# Altium project Keyboard_100.PrjPcb
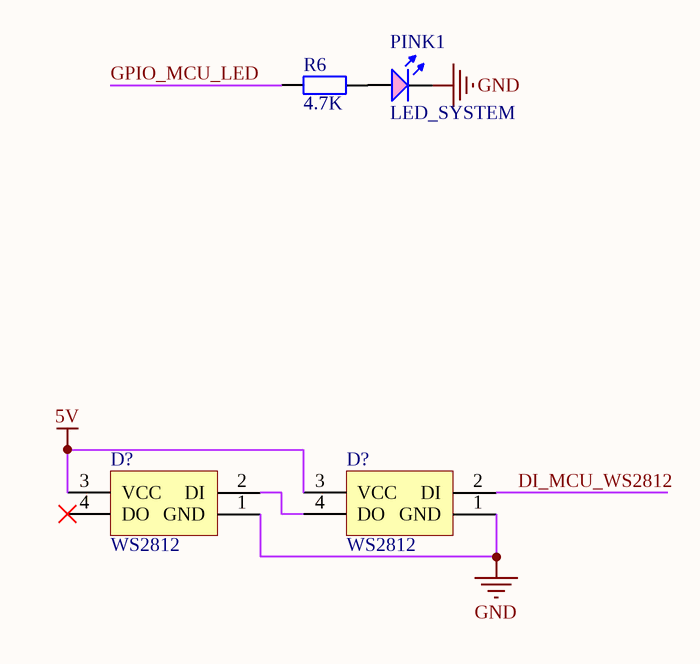
[diagram p0: LED.SchDoc]
4 sheets, 226 parts. Net scope: global (net labels, ports and power ports of the same name join across sheets).
Board file: Keyboard_100.PcbDoc
Sheets:
  LED.SchDoc
  KEY_Pad.SchDoc
  MCU.SchDoc
  NRF24L01.SchDoc

## Sheet LED.SchDoc
size A4

### Parts
(Parts that share a designator on the sheet are numbered #1, #2 ... from top to bottom, then left to right.)
D?#1  WS2812  [RGB_LED_1206]
D?#2  WS2812  [RGB_LED_1206]
PINK1  LED_SYSTEM  [LED_0603_R]
R6  4.7K  [Res-0603]

### Nets
5V: D?#1.3(VCC) D?#2.3(VCC)
GND: D?#1.1(GND) D?#2.1(GND) PINK1.2(K)
DI_MCU_WS2812: D?#2.2(DI)
GPIO_MCU_LED: R6.2
NetD?#1_2: D?#1.2(DI) D?#2.4(DO)
NetPINK1_1: PINK1.1(A) R6.1

Not connected (* = marked no-connect by the designer): D?#1 4(DO)*

### Notes on the sheet
- Title
- Size:
- Date:
- A4
- Number:
- Time:
- Revision:
- Sheet
- of
- File:

### Library data of the parts
PINK1 = LED_SMD_PINK: 发光二极管; ComponentLink1Description: 供应商链接; ComponentLink1URL: http://www.szlcsc.com/product/details_2659.html; Package: 0603; Supplier: LC; SuppliersPartNumber: C2286
R6 = RES: 贴片电阻
D?#1 D?#2 = WS2812: Publisher: mazhongwei; Published: 8-August-2017; PackageReference: RGB_LED_5050

## Sheet KEY_Pad.SchDoc
size A2
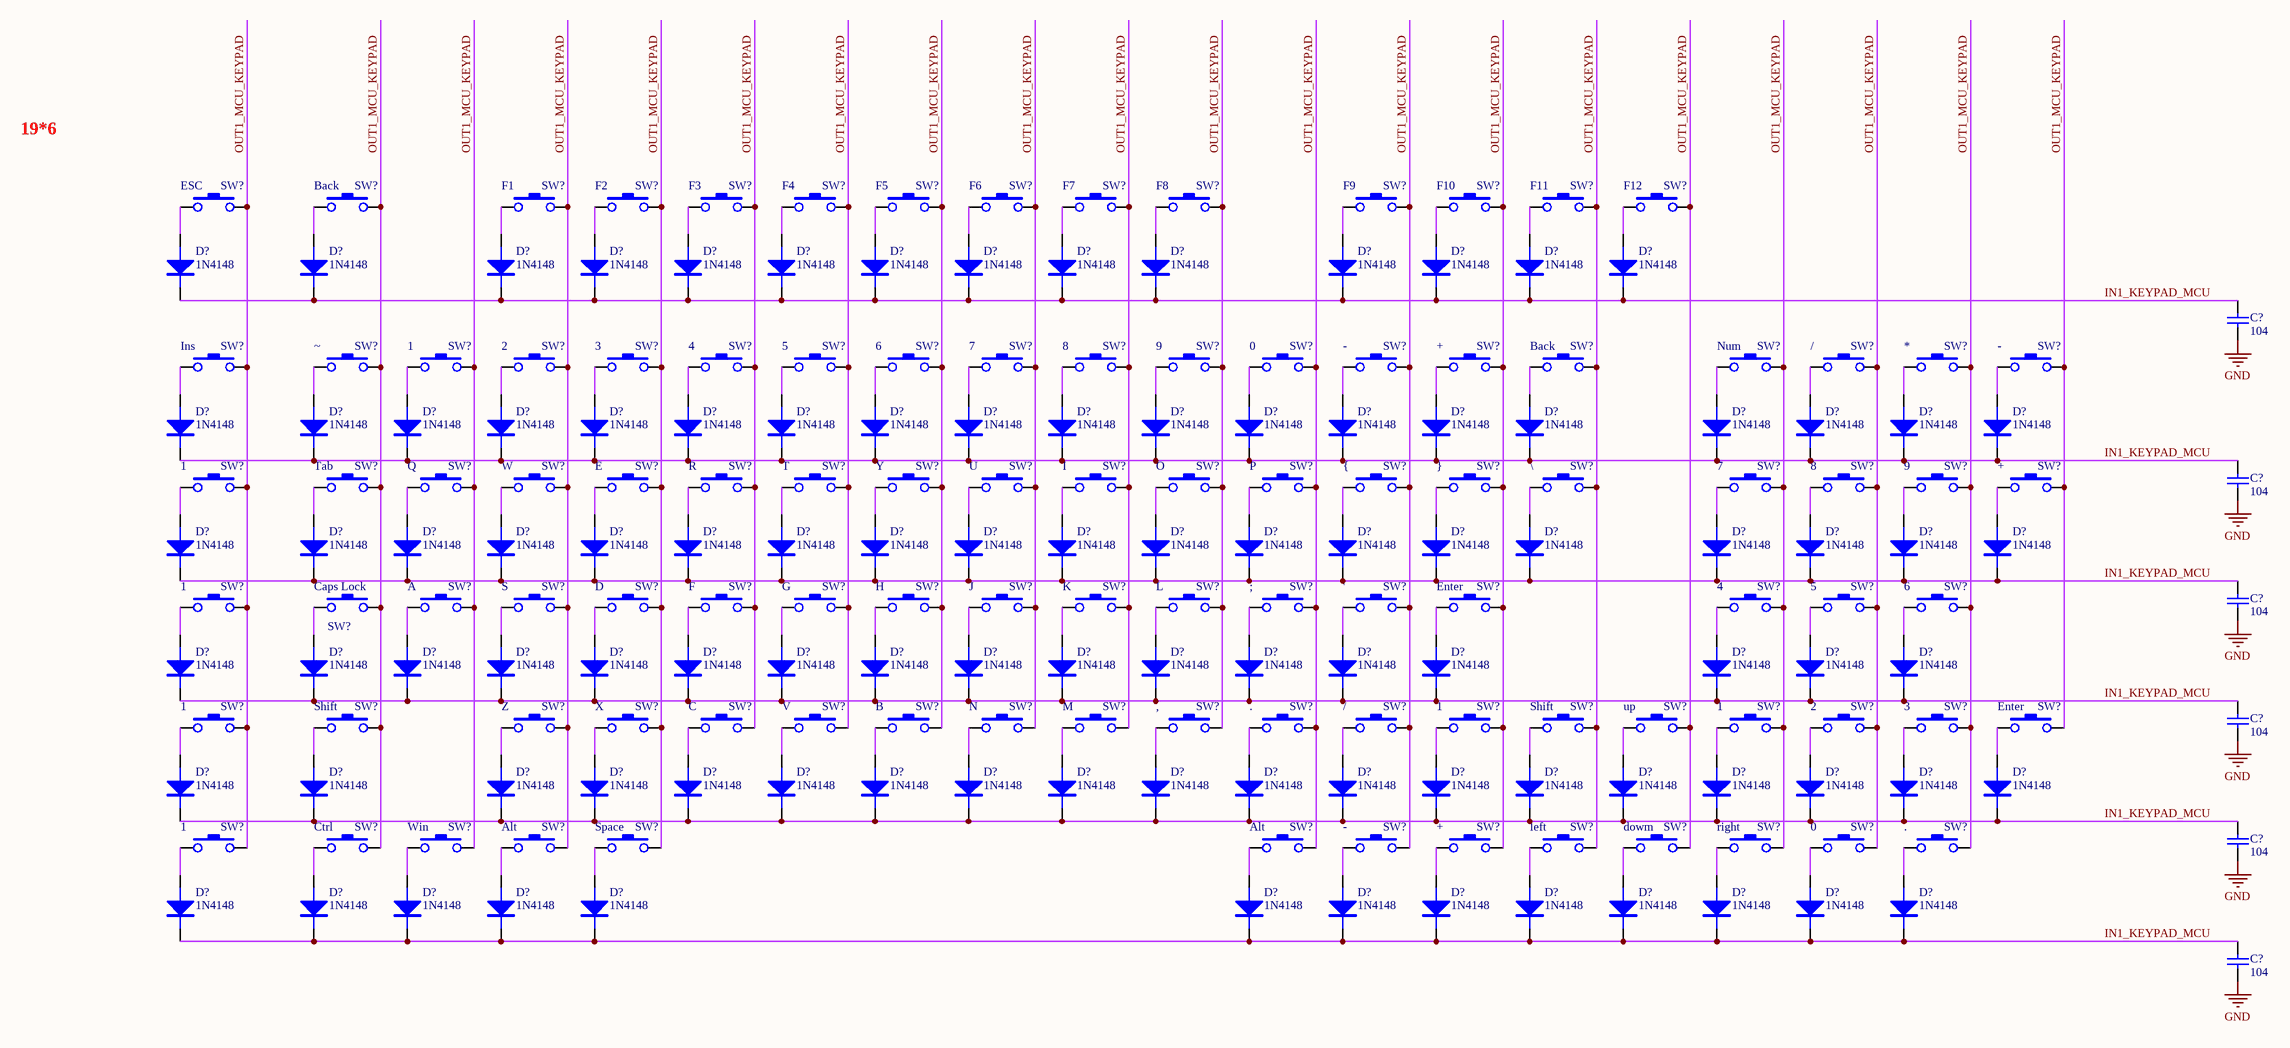
[diagram p1: KEY_Pad.SchDoc]

### Parts
(Parts that share a designator on the sheet are numbered #1, #2 ... from top to bottom, then left to right.)
C?#1  104  [Cap-0603]
C?#2  104  [Cap-0603]
C?#3  104  [Cap-0603]
C?#4  104  [Cap-0603]
C?#5  104  [Cap-0603]
C?#6  104  [Cap-0603]
D?#3  1N4148  [SOD-523]
D?#4  1N4148  [SOD-523]
D?#5  1N4148  [SOD-523]
D?#6  1N4148  [SOD-523]
D?#7  1N4148  [SOD-523]
D?#8  1N4148  [SOD-523]
D?#9  1N4148  [SOD-523]
D?#10  1N4148  [SOD-523]
D?#11  1N4148  [SOD-523]
D?#12  1N4148  [SOD-523]
D?#13  1N4148  [SOD-523]
D?#14  1N4148  [SOD-523]
D?#15  1N4148  [SOD-523]
D?#16  1N4148  [SOD-523]
D?#17  1N4148  [SOD-523]
D?#18  1N4148  [SOD-523]
D?#19  1N4148  [SOD-523]
D?#20  1N4148  [SOD-523]
D?#21  1N4148  [SOD-523]
D?#22  1N4148  [SOD-523]
D?#23  1N4148  [SOD-523]
D?#24  1N4148  [SOD-523]
D?#25  1N4148  [SOD-523]
D?#26  1N4148  [SOD-523]
D?#27  1N4148  [SOD-523]
D?#28  1N4148  [SOD-523]
D?#29  1N4148  [SOD-523]
D?#30  1N4148  [SOD-523]
D?#31  1N4148  [SOD-523]
D?#32  1N4148  [SOD-523]
D?#33  1N4148  [SOD-523]
D?#34  1N4148  [SOD-523]
D?#35  1N4148  [SOD-523]
D?#36  1N4148  [SOD-523]
D?#37  1N4148  [SOD-523]
D?#38  1N4148  [SOD-523]
D?#39  1N4148  [SOD-523]
D?#40  1N4148  [SOD-523]
D?#41  1N4148  [SOD-523]
D?#42  1N4148  [SOD-523]
D?#43  1N4148  [SOD-523]
D?#44  1N4148  [SOD-523]
D?#45  1N4148  [SOD-523]
D?#46  1N4148  [SOD-523]
D?#47  1N4148  [SOD-523]
D?#48  1N4148  [SOD-523]
D?#49  1N4148  [SOD-523]
D?#50  1N4148  [SOD-523]
D?#51  1N4148  [SOD-523]
D?#52  1N4148  [SOD-523]
D?#53  1N4148  [SOD-523]
D?#54  1N4148  [SOD-523]
D?#55  1N4148  [SOD-523]
D?#56  1N4148  [SOD-523]
D?#57  1N4148  [SOD-523]
D?#58  1N4148  [SOD-523]
D?#59  1N4148  [SOD-523]
D?#60  1N4148  [SOD-523]
D?#61  1N4148  [SOD-523]
D?#62  1N4148  [SOD-523]
D?#63  1N4148  [SOD-523]
D?#64  1N4148  [SOD-523]
D?#65  1N4148  [SOD-523]
D?#66  1N4148  [SOD-523]
D?#67  1N4148  [SOD-523]
D?#68  1N4148  [SOD-523]
D?#69  1N4148  [SOD-523]
D?#70  1N4148  [SOD-523]
D?#71  1N4148  [SOD-523]
D?#72  1N4148  [SOD-523]
D?#73  1N4148  [SOD-523]
D?#74  1N4148  [SOD-523]
D?#75  1N4148  [SOD-523]
D?#76  1N4148  [SOD-523]
D?#77  1N4148  [SOD-523]
D?#78  1N4148  [SOD-523]
D?#79  1N4148  [SOD-523]
D?#80  1N4148  [SOD-523]
D?#81  1N4148  [SOD-523]
D?#82  1N4148  [SOD-523]
D?#83  1N4148  [SOD-523]
D?#84  1N4148  [SOD-523]
D?#85  1N4148  [SOD-523]
D?#86  1N4148  [SOD-523]
D?#87  1N4148  [SOD-523]
D?#88  1N4148  [SOD-523]
D?#89  1N4148  [SOD-523]
D?#90  1N4148  [SOD-523]
D?#91  1N4148  [SOD-523]
D?#92  1N4148  [SOD-523]
D?#93  1N4148  [SOD-523]
D?#94  1N4148  [SOD-523]
D?#95  1N4148  [SOD-523]
D?#96  1N4148  [SOD-523]
D?#97  1N4148  [SOD-523]
D?#98  1N4148  [SOD-523]
D?#99  1N4148  [SOD-523]
D?#100  1N4148  [SOD-523]
D?#101  1N4148  [SOD-523]
D?#102  1N4148  [SOD-523]
D?#103  1N4148  [SOD-523]
SW?#1  ESC  [MX_SW-4]
SW?#2  Back  [MX_SW-4]
SW?#3  F1  [MX_SW-4]
SW?#4  F2  [MX_SW-4]
SW?#5  F3  [MX_SW-4]
SW?#6  F4  [MX_SW-4]
SW?#7  F5  [MX_SW-4]
SW?#8  F6  [MX_SW-4]
SW?#9  F7  [MX_SW-4]
SW?#10  F8  [MX_SW-4]
SW?#11  F9  [MX_SW-4]
SW?#12  F10  [MX_SW-4]
SW?#13  F11  [MX_SW-4]
SW?#14  F12  [MX_SW-4]
SW?#15  Ins  [MX_SW-4]
SW?#16  ~  [MX_SW-4]
SW?#17  1  [MX_SW-4]
SW?#18  2  [MX_SW-4]
SW?#19  3  [MX_SW-4]
SW?#20  4  [MX_SW-4]
SW?#21  5  [MX_SW-4]
SW?#22  6  [MX_SW-4]
SW?#23  7  [MX_SW-4]
SW?#24  8  [MX_SW-4]
SW?#25  9  [MX_SW-4]
SW?#26  0  [MX_SW-4]
SW?#27  -  [MX_SW-4]
SW?#28  +  [MX_SW-4]
SW?#29  Back  [MX_SW-4]
SW?#30  Num  [MX_SW-4]
SW?#31  /  [MX_SW-4]
SW?#32  *  [MX_SW-4]
SW?#33  -  [MX_SW-4]
SW?#34  1  [MX_SW-4]
SW?#35  Tab  [MX_SW-4]
SW?#36  Q  [MX_SW-4]
SW?#37  W  [MX_SW-4]
SW?#38  E  [MX_SW-4]
SW?#39  R  [MX_SW-4]
SW?#40  T  [MX_SW-4]
SW?#41  Y  [MX_SW-4]
SW?#42  U  [MX_SW-4]
SW?#43  I  [MX_SW-4]
SW?#44  O  [MX_SW-4]
SW?#45  P  [MX_SW-4]
SW?#46  {  [MX_SW-4]
SW?#47  }  [MX_SW-4]
SW?#48  \  [MX_SW-4]
SW?#49  7  [MX_SW-4]
SW?#50  8  [MX_SW-4]
SW?#51  9  [MX_SW-4]
SW?#52  +  [MX_SW-4]
SW?#53  1  [MX_SW-4]
SW?#54  Caps Lock  [MX_SW-4]
SW?#55  A  [MX_SW-4]
SW?#56  S  [MX_SW-4]
SW?#57  D  [MX_SW-4]
SW?#58  F  [MX_SW-4]
SW?#59  G  [MX_SW-4]
SW?#60  H  [MX_SW-4]
SW?#61  J  [MX_SW-4]
SW?#62  K  [MX_SW-4]
SW?#63  L  [MX_SW-4]
SW?#64  ;  [MX_SW-4]
SW?#65  '  [MX_SW-4]
SW?#66  Enter  [MX_SW-4]
SW?#67  4  [MX_SW-4]
SW?#68  5  [MX_SW-4]
SW?#69  6  [MX_SW-4]
SW?#70  1  [MX_SW-4]
SW?#71  Shift  [MX_SW-4]
SW?#72  Z  [MX_SW-4]
SW?#73  X  [MX_SW-4]
SW?#74  C  [MX_SW-4]
SW?#75  V  [MX_SW-4]
SW?#76  B  [MX_SW-4]
SW?#77  N  [MX_SW-4]
SW?#78  M  [MX_SW-4]
SW?#79  ,  [MX_SW-4]
SW?#80  .  [MX_SW-4]
SW?#81  /  [MX_SW-4]
SW?#82  1  [MX_SW-4]
SW?#83  Shift  [MX_SW-4]
SW?#84  up  [MX_SW-4]
SW?#85  1  [MX_SW-4]
SW?#86  2  [MX_SW-4]
SW?#87  3  [MX_SW-4]
SW?#88  Enter  [MX_SW-4]
SW?#89  1  [MX_SW-4]
SW?#90  Ctrl  [MX_SW-4]
SW?#91  Win  [MX_SW-4]
SW?#92  Alt  [MX_SW-4]
SW?#93  Space  [MX_SW-4]
SW?#94  Alt  [MX_SW-4]
SW?#95  -  [MX_SW-4]
SW?#96  +  [MX_SW-4]
SW?#97  left  [MX_SW-4]
SW?#98  dowm  [MX_SW-4]
SW?#99  right  [MX_SW-4]
SW?#100  0  [MX_SW-4]
SW?#101  .  [MX_SW-4]

### Nets
GND: C?#1.2 C?#2.2 C?#3.2 C?#4.2 C?#5.2 C?#6.2
IN1_KEYPAD_MCU: C?#1.1 C?#2.1 C?#3.1 C?#4.1 C?#5.1 C?#6.1 D?#3.K D?#4.K D?#5.K D?#6.K D?#7.K D?#8.K D?#9.K D?#10.K D?#11.K D?#12.K D?#13.K D?#14.K D?#15.K D?#16.K D?#17.K D?#18.K D?#19.K D?#20.K D?#21.K D?#22.K D?#23.K D?#24.K D?#25.K D?#26.K D?#27.K D?#28.K D?#29.K D?#30.K D?#31.K D?#32.K D?#33.K D?#34.K D?#35.K D?#36.K D?#37.K D?#38.K D?#39.K D?#40.K D?#41.K D?#42.K D?#43.K D?#44.K D?#45.K D?#46.K D?#47.K D?#48.K D?#49.K D?#50.K D?#51.K D?#52.K D?#53.K D?#54.K D?#55.K D?#56.K D?#57.K D?#58.K D?#59.K D?#60.K D?#61.K D?#62.K D?#63.K D?#64.K D?#65.K D?#66.K D?#67.K D?#68.K D?#69.K D?#70.K D?#71.K D?#72.K D?#73.K D?#74.K D?#75.K D?#76.K D?#77.K D?#78.K D?#79.K D?#80.K D?#81.K D?#82.K D?#83.K D?#84.K D?#85.K D?#86.K D?#87.K D?#88.K D?#89.K D?#90.K D?#91.K D?#92.K D?#93.K D?#94.K D?#95.K D?#96.K D?#97.K D?#98.K D?#99.K D?#100.K D?#101.K D?#102.K D?#103.K
OUT1_MCU_KEYPAD: SW?#1.2 SW?#2.2 SW?#3.2 SW?#4.2 SW?#5.2 SW?#6.2 SW?#7.2 SW?#8.2 SW?#9.2 SW?#10.2 SW?#11.2 SW?#12.2 SW?#13.2 SW?#14.2 SW?#15.2 SW?#16.2 SW?#17.2 SW?#18.2 SW?#19.2 SW?#20.2 SW?#21.2 SW?#22.2 SW?#23.2 SW?#24.2 SW?#25.2 SW?#26.2 SW?#27.2 SW?#28.2 SW?#29.2 SW?#30.2 SW?#31.2 SW?#32.2 SW?#33.2 SW?#34.2 SW?#35.2 SW?#36.2 SW?#37.2 SW?#38.2 SW?#39.2 SW?#40.2 SW?#41.2 SW?#42.2 SW?#43.2 SW?#44.2 SW?#45.2 SW?#46.2 SW?#47.2 SW?#48.2 SW?#49.2 SW?#50.2 SW?#51.2 SW?#52.2 SW?#53.2 SW?#54.2 SW?#55.2 SW?#56.2 SW?#57.2 SW?#58.2 SW?#59.2 SW?#60.2 SW?#61.2 SW?#62.2 SW?#63.2 SW?#64.2 SW?#65.2 SW?#66.2 SW?#67.2 SW?#68.2 SW?#69.2 SW?#70.2 SW?#71.2 SW?#72.2 SW?#73.2 SW?#74.2 SW?#75.2 SW?#76.2 SW?#77.2 SW?#78.2 SW?#79.2 SW?#80.2 SW?#81.2 SW?#82.2 SW?#83.2 SW?#84.2 SW?#85.2 SW?#86.2 SW?#87.2 SW?#88.2 SW?#89.2 SW?#90.2 SW?#91.2 SW?#92.2 SW?#93.2 SW?#94.2 SW?#95.2 SW?#96.2 SW?#97.2 SW?#98.2 SW?#99.2 SW?#100.2 SW?#101.2
NetD?#3_A: D?#3.A SW?#1.1
NetD?#4_A: D?#4.A SW?#2.1
NetD?#5_A: D?#5.A SW?#3.1
NetD?#6_A: D?#6.A SW?#4.1
NetD?#7_A: D?#7.A SW?#5.1
NetD?#8_A: D?#8.A SW?#6.1
NetD?#9_A: D?#9.A SW?#7.1
NetD?#10_A: D?#10.A SW?#8.1
NetD?#11_A: D?#11.A SW?#9.1
NetD?#12_A: D?#12.A SW?#10.1
NetD?#13_A: D?#13.A SW?#11.1
NetD?#14_A: D?#14.A SW?#12.1
NetD?#15_A: D?#15.A SW?#13.1
NetD?#16_A: D?#16.A SW?#14.1
NetD?#17_A: D?#17.A SW?#15.1
NetD?#18_A: D?#18.A SW?#16.1
NetD?#19_A: D?#19.A SW?#17.1
NetD?#20_A: D?#20.A SW?#18.1
NetD?#21_A: D?#21.A SW?#19.1
NetD?#22_A: D?#22.A SW?#20.1
NetD?#23_A: D?#23.A SW?#21.1
NetD?#24_A: D?#24.A SW?#22.1
NetD?#25_A: D?#25.A SW?#23.1
NetD?#26_A: D?#26.A SW?#24.1
NetD?#27_A: D?#27.A SW?#25.1
NetD?#28_A: D?#28.A SW?#26.1
NetD?#29_A: D?#29.A SW?#27.1
NetD?#30_A: D?#30.A SW?#28.1
NetD?#31_A: D?#31.A SW?#29.1
NetD?#32_A: D?#32.A SW?#30.1
NetD?#33_A: D?#33.A SW?#31.1
NetD?#34_A: D?#34.A SW?#32.1
NetD?#35_A: D?#35.A SW?#33.1
NetD?#36_A: D?#36.A SW?#34.1
NetD?#37_A: D?#37.A SW?#35.1
NetD?#38_A: D?#38.A SW?#36.1
NetD?#39_A: D?#39.A SW?#37.1
NetD?#40_A: D?#40.A SW?#38.1
NetD?#41_A: D?#41.A SW?#39.1
NetD?#42_A: D?#42.A SW?#40.1
NetD?#43_A: D?#43.A SW?#41.1
NetD?#44_A: D?#44.A SW?#42.1
NetD?#45_A: D?#45.A SW?#43.1
NetD?#46_A: D?#46.A SW?#44.1
NetD?#47_A: D?#47.A SW?#45.1
NetD?#48_A: D?#48.A SW?#46.1
NetD?#49_A: D?#49.A SW?#47.1
NetD?#50_A: D?#50.A SW?#48.1
NetD?#51_A: D?#51.A SW?#49.1
NetD?#52_A: D?#52.A SW?#50.1
NetD?#53_A: D?#53.A SW?#51.1
NetD?#54_A: D?#54.A SW?#52.1
NetD?#55_A: D?#55.A SW?#53.1
NetD?#56_A: D?#56.A SW?#54.1
NetD?#57_A: D?#57.A SW?#55.1
NetD?#58_A: D?#58.A SW?#56.1
NetD?#59_A: D?#59.A SW?#57.1
NetD?#60_A: D?#60.A SW?#58.1
NetD?#61_A: D?#61.A SW?#59.1
NetD?#62_A: D?#62.A SW?#60.1
NetD?#63_A: D?#63.A SW?#61.1
NetD?#64_A: D?#64.A SW?#62.1
NetD?#65_A: D?#65.A SW?#63.1
NetD?#66_A: D?#66.A SW?#64.1
NetD?#67_A: D?#67.A SW?#65.1
NetD?#68_A: D?#68.A SW?#66.1
NetD?#69_A: D?#69.A SW?#67.1
NetD?#70_A: D?#70.A SW?#68.1
NetD?#71_A: D?#71.A SW?#69.1
NetD?#72_A: D?#72.A SW?#70.1
NetD?#73_A: D?#73.A SW?#71.1
NetD?#74_A: D?#74.A SW?#72.1
NetD?#75_A: D?#75.A SW?#73.1
NetD?#76_A: D?#76.A SW?#74.1
NetD?#77_A: D?#77.A SW?#75.1
NetD?#78_A: D?#78.A SW?#76.1
NetD?#79_A: D?#79.A SW?#77.1
NetD?#80_A: D?#80.A SW?#78.1
NetD?#81_A: D?#81.A SW?#79.1
NetD?#82_A: D?#82.A SW?#80.1
NetD?#83_A: D?#83.A SW?#81.1
NetD?#84_A: D?#84.A SW?#82.1
NetD?#85_A: D?#85.A SW?#83.1
NetD?#86_A: D?#86.A SW?#84.1
NetD?#87_A: D?#87.A SW?#85.1
NetD?#88_A: D?#88.A SW?#86.1
NetD?#89_A: D?#89.A SW?#87.1
NetD?#90_A: D?#90.A SW?#88.1
NetD?#91_A: D?#91.A SW?#89.1
NetD?#92_A: D?#92.A SW?#90.1
NetD?#93_A: D?#93.A SW?#91.1
NetD?#94_A: D?#94.A SW?#92.1
NetD?#95_A: D?#95.A SW?#93.1
NetD?#96_A: D?#96.A SW?#94.1
NetD?#97_A: D?#97.A SW?#95.1
NetD?#98_A: D?#98.A SW?#96.1
NetD?#99_A: D?#99.A SW?#97.1
NetD?#100_A: D?#100.A SW?#98.1
NetD?#101_A: D?#101.A SW?#99.1
NetD?#102_A: D?#102.A SW?#100.1
NetD?#103_A: D?#103.A SW?#101.1

### Notes on the sheet
- 19*6
- Title
- Size:
- Date:
- File:
- A2
- Number:
- Time:
- Revision:
- Sheet
- of

### Library data of the parts
C?#1-C?#6 = CAP: 贴片陶瓷电容
D?#3-D?#103 = DIODE: 普通二极管
SW?#1-SW?#101 = MX_SW-4: with Fixation pins  1-Pole

## Sheet MCU.SchDoc
size A4
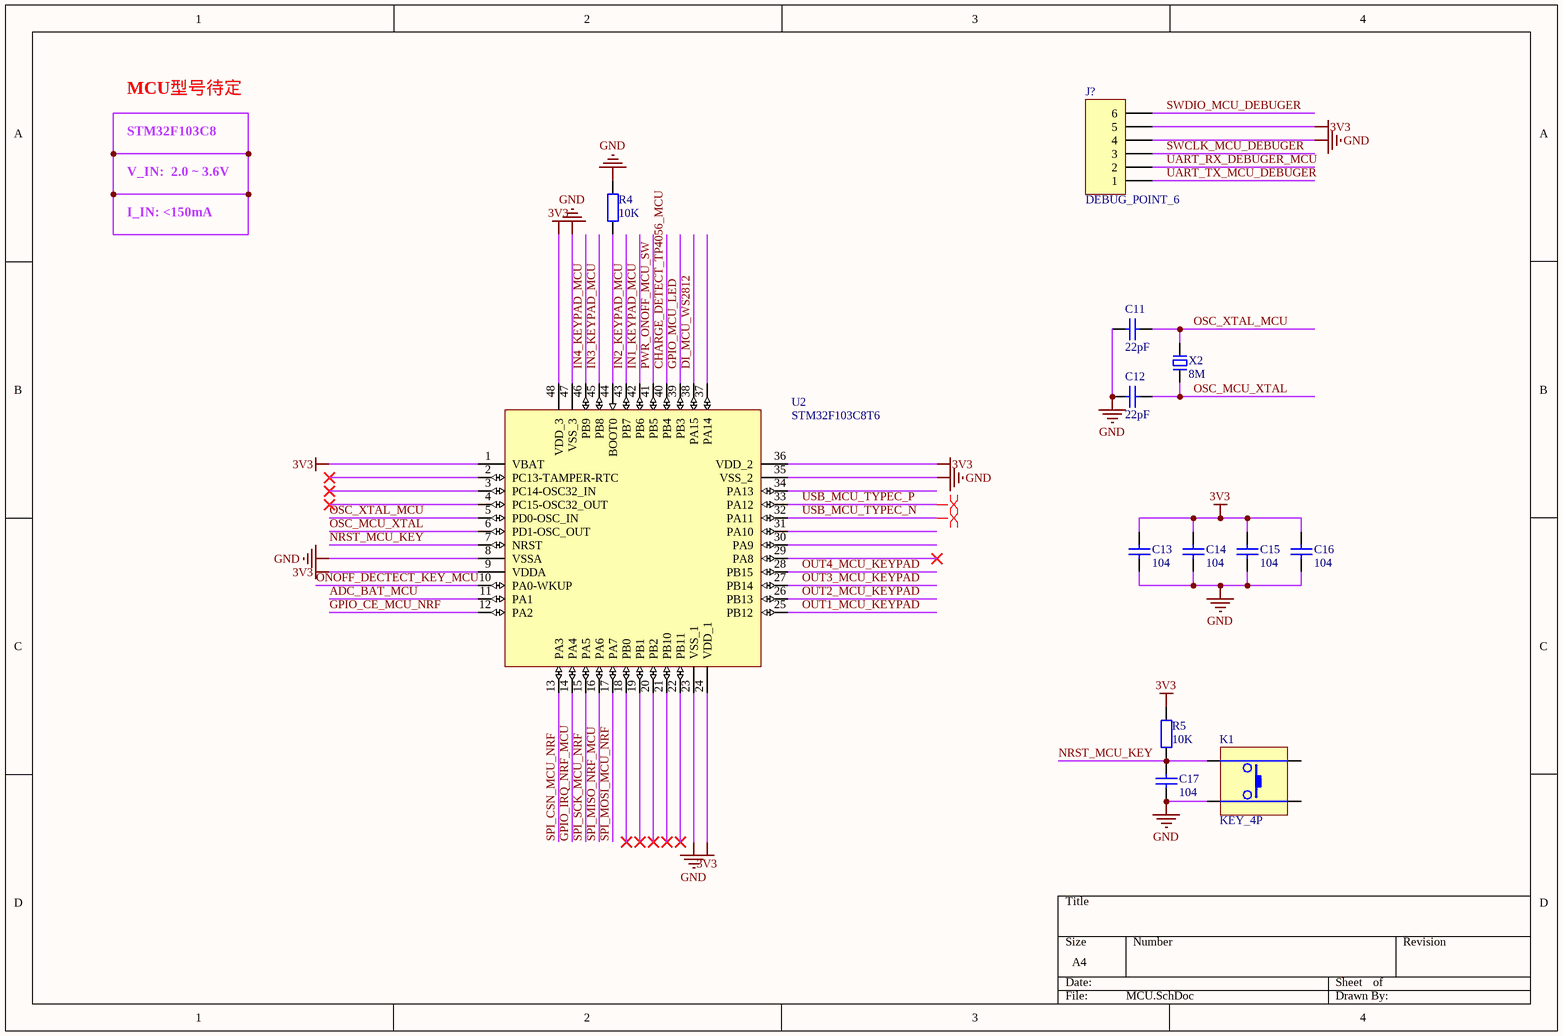
[diagram p2: MCU.SchDoc]

### Parts
C11  22pF  [Cap-0603]
C12  22pF  [Cap-0603]
C13  104  [Cap-0603]
C14  104  [Cap-0603]
C15  104  [Cap-0603]
C16  104  [Cap-0603]
C17  104  [Cap-0603]
J?  DEBUG_POINT_6  [DEBUG_POINT_6]
K1  KEY_4P  [SW-SMD-3X4X2.5]
R4  10K  [Res-0603]
R5  10K  [Res-0603]
U2  STM32F103C8T6  [STM32F103C8T6]
X2  8M  [OSC 5032-2P]

### Nets
3V3: C13.2 C14.2 C15.2 C16.2 J?.5 R5.2 U2.1(VBAT) U2.9(VDDA) U2.24(VDD_1) U2.36(VDD_2) U2.48(VDD_3)
GND: C11.1 C12.1 C13.1 C14.1 C15.1 C16.1 C17.1 J?.4 K1.4 R4.2 U2.8(VSSA) U2.23(VSS_1) U2.35(VSS_2) U2.47(VSS_3)
ADC_BAT_MCU: U2.11(PA1)
CHARGE_DETECT_TP4056_MCU: U2.40(PB4)
DI_MCU_WS2812: U2.38(PA15)
GPIO_CE_MCU_NRF: U2.12(PA2)
GPIO_IRQ_NRF_MCU: U2.14(PA4)
GPIO_MCU_LED: U2.39(PB3)
IN1_KEYPAD_MCU: U2.42(PB6)
IN2_KEYPAD_MCU: U2.43(PB7)
IN3_KEYPAD_MCU: U2.45(PB8)
IN4_KEYPAD_MCU: U2.46(PB9)
NRST_MCU_KEY: C17.2 K1.3 R5.1 U2.7(NRST)
ONOFF_DECTECT_KEY_MCU: U2.10(PA0-WKUP)
OSC_MCU_XTAL: C12.2 U2.6(PD1-OSC_OUT) X2.1
OSC_XTAL_MCU: C11.2 U2.5(PD0-OSC_IN) X2.2
OUT1_MCU_KEYPAD: U2.25(PB12)
OUT2_MCU_KEYPAD: U2.26(PB13)
OUT3_MCU_KEYPAD: U2.27(PB14)
OUT4_MCU_KEYPAD: U2.28(PB15)
PWR_ONOFF_MCU_SW: U2.41(PB5)
SPI_CSN_MCU_NRF: U2.13(PA3)
SPI_MISO_NRF_MCU: U2.16(PA6)
SPI_MOSI_MCU_NRF: U2.17(PA7)
SPI_SCK_MCU_NRF: U2.15(PA5)
SWCLK_MCU_DEBUGER: J?.3
SWDIO_MCU_DEBUGER: J?.6
UART_RX_DEBUGER_MCU: J?.2
UART_TX_MCU_DEBUGER: J?.1
USB_MCU_TYPEC_N: U2.32(PA11)
USB_MCU_TYPEC_P: U2.33(PA12)
NetR4_1: R4.1 U2.44(BOOT0)

Not connected (* = marked no-connect by the designer): K1 1 2; U2 2(PC13-TAMPER-RTC)* 3(PC14-OSC32_IN)* 4(PC15-OSC32_OUT)* 18(PB0)* 19(PB1)* 20(PB2)* 21(PB10)* 22(PB11)* 29(PA8)* 30(PA9) 31(PA10) 34(PA13) 37(PA14)

### Layout directives
differential pair: USB_MCU_TYPEC_N, USB_MCU_TYPEC_P

### Notes on the sheet
- MCU型号待定
- STM32F103C8
- V_IN:  2.0～3.6V
- I_IN: <150mA

### Library data of the parts
C11-C17 = CAP: 贴片陶瓷电容
R4 R5 = RES: 贴片电阻
U2 = STM32F103C8T6: ARM Cortex-M3 32-bit MCU, 64 KB Flash, 20 KB Internal RAM, 37 I/Os, 48-pin LQFP, -40 to 85 degC, Tray; A/D Converter: 2x12-bit (10 Channel); FLASH Size (Prog) (kB): 64; I/Os (High Current): 37; Internal RAM Size (kB): 20; Operating Frequency(F) (Processor speed) (MHz): 72; Supply Voltage(Vcc) min (V): 2; DatasheetVersion: Rev. 16; PackageVersion: Rev. 6, 06/2013; PackageReference: LQFP48; PackageDescription: 48-Pin Low Profile Quad Flat Package, 7 x 7 mm Body, 0.5 mm Pitch; Supplier 1: Digi-Key; Supplier Part Number 1: 497-6063-ND; Supplier 2: Farnell; Supplier Part Number 2: 1447637; Supplier 3: Newark; Supplier Part Number 3: 59M2182; Supplier 4: Newark; Supplier Part Number 4: 57P1222; Supplier 5: Mouser; Supplier Part Number 5: 511-STM32F103C8T6; Core: ARM Cortex-M3; Packing: Tray; Mounting Technology: Surface Mount; PartNumber: STM32F103C8T6; ComponentLink1Description: Manufacturer URL; ComponentLink1URL: http://www.st.com/web/en/home.html; ComponentLink2Description: Datasheet; ComponentLink2URL: http://www.st.com/st-web-ui/static/active/en/resource/technical/document/datasheet/CD00161566.pdf; ComponentLink3Description: Package Specification; ComponentLink3URL: http://www.st.com/st-web-ui/static/active/en/resource/technical/document/datasheet/DM00058181.pdf
X2 = XTAL-2P: 2脚无源脚晶振

## Sheet NRF24L01.SchDoc
size A4; Organization: Altium Limited; Address1: L3, 12a Rodborough Rd; Address2: Frenchs Forest; Address3: NSW; Address4: Australia 2086
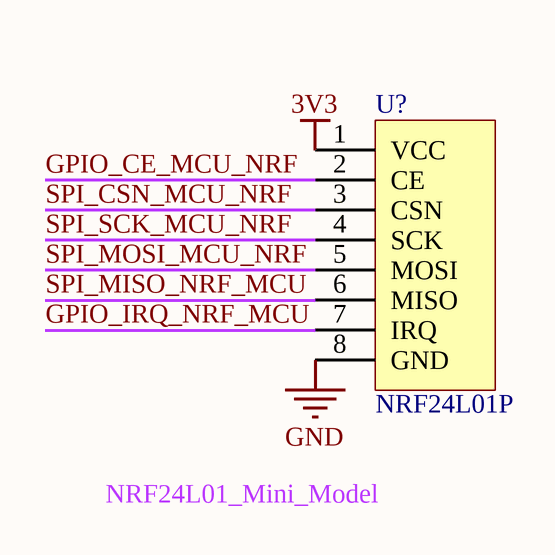
[diagram p3: NRF24L01.SchDoc]

### Parts
U?  NRF24L01P  [NRF24L01P]

### Nets
3V3: U?.1(VCC)
GND: U?.8(GND)
GPIO_CE_MCU_NRF: U?.2(CE)
GPIO_IRQ_NRF_MCU: U?.7(IRQ)
SPI_CSN_MCU_NRF: U?.3(CSN)
SPI_MISO_NRF_MCU: U?.6(MISO)
SPI_MOSI_MCU_NRF: U?.5(MOSI)
SPI_SCK_MCU_NRF: U?.4(SCK)

### Notes on the sheet
- NRF24L01_Mini_Model
- Title
- Size:
- Date:
- A4
- Number:
- Time:
- Revision:
- Sheet
- of
- File:

### Library data of the parts
U? = NRF24L01P: 2.4G无线模块

## Nets that join several sheets
3V3: MCU (11 pins), NRF24L01 (U?.1)
GND: LED (D?#1.1 D?#2.1 PINK1.2), KEY_Pad (6 pins), MCU (14 pins), NRF24L01 (U?.8)
DI_MCU_WS2812: LED (D?#2.2), MCU (U2.38)
GPIO_CE_MCU_NRF: MCU (U2.12), NRF24L01 (U?.2)
GPIO_IRQ_NRF_MCU: MCU (U2.14), NRF24L01 (U?.7)
GPIO_MCU_LED: LED (R6.2), MCU (U2.39)
IN1_KEYPAD_MCU: KEY_Pad (107 pins), MCU (U2.42)
OUT1_MCU_KEYPAD: KEY_Pad (101 pins), MCU (U2.25)
SPI_CSN_MCU_NRF: MCU (U2.13), NRF24L01 (U?.3)
SPI_MISO_NRF_MCU: MCU (U2.16), NRF24L01 (U?.6)
SPI_MOSI_MCU_NRF: MCU (U2.17), NRF24L01 (U?.5)
SPI_SCK_MCU_NRF: MCU (U2.15), NRF24L01 (U?.4)